# Altium schematic sheet ThermocoupleADC.SchDoc
size A3; SheetNumber: 5; SheetTotal: 6
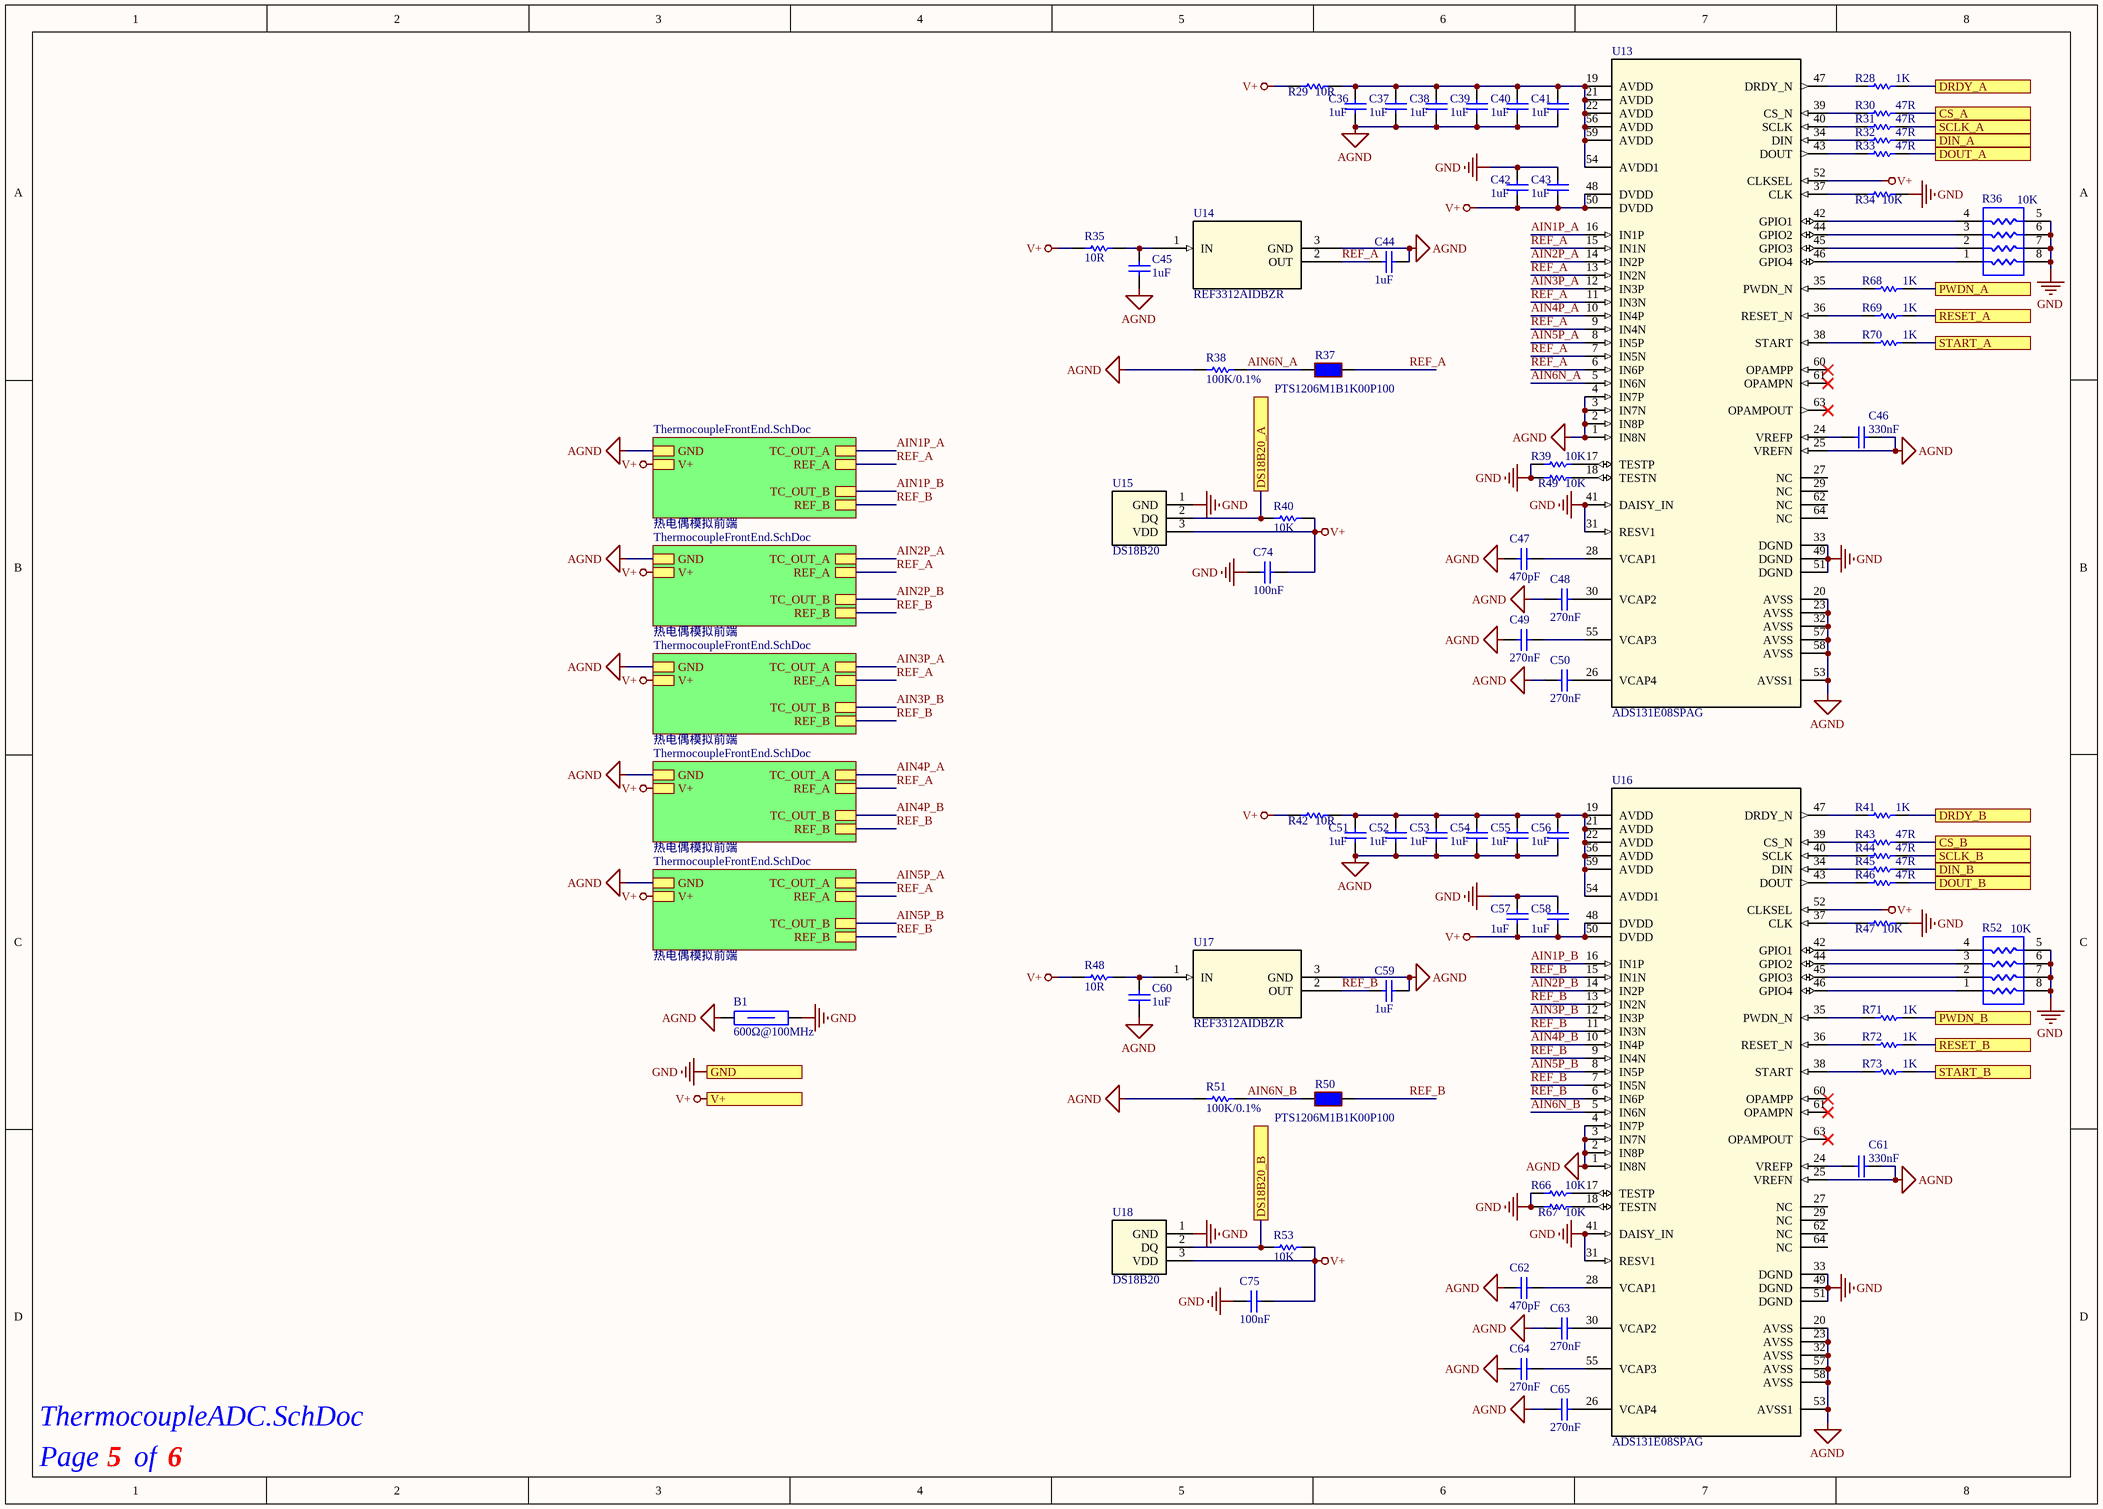
[diagram p0: ThermocoupleADC.SchDoc]

## Parts
B1  600Ω@100MHz  [R0805_L]
C36  1uF  [R0603_C]
C37  1uF  [R0603_C]
C38  1uF  [R0603_C]
C39  1uF  [R0603_C]
C40  1uF  [R0603_C]
C41  1uF  [R0603_C]
C42  1uF  [R0603_C]
C43  1uF  [R0603_C]
C44  1uF  [R0603_C]
C45  1uF  [R0603_C]
C46  330nF  [R0603_C]
C47  470pF  [R0603_C]
C48  270nF  [R0603_C]
C49  270nF  [R0603_C]
C50  270nF  [R0603_C]
C51  1uF  [R0603_C]
C52  1uF  [R0603_C]
C53  1uF  [R0603_C]
C54  1uF  [R0603_C]
C55  1uF  [R0603_C]
C56  1uF  [R0603_C]
C57  1uF  [R0603_C]
C58  1uF  [R0603_C]
C59  1uF  [R0603_C]
C60  1uF  [R0603_C]
C61  330nF  [R0603_C]
C62  470pF  [R0603_C]
C63  270nF  [R0603_C]
C64  270nF  [R0603_C]
C65  270nF  [R0603_C]
C74  100nF  [R0603_C]
C75  100nF  [R0603_C]
R28  1K  [R0603_R]
R29  10R  [R0603_R]
R30  47R  [R0603_R]
R31  47R  [R0603_R]
R32  47R  [R0603_R]
R33  47R  [R0603_R]
R34  10K  [R0603_R]
R35  10R  [R0603_R]
R36  10K  [R0603X4]
R37  PTS1206M1B1K00P100  [R1206_R]
R38  100K/0.1%  [R0603_R]
R39  10K  [R0603_R]
R40  10K  [R0603_R]
R41  1K  [R0603_R]
R42  10R  [R0603_R]
R43  47R  [R0603_R]
R44  47R  [R0603_R]
R45  47R  [R0603_R]
R46  47R  [R0603_R]
R47  10K  [R0603_R]
R48  10R  [R0603_R]
R49  10K  [R0603_R]
R50  PTS1206M1B1K00P100  [R1206_R]
R51  100K/0.1%  [R0603_R]
R52  10K  [R0603X4]
R53  10K  [R0603_R]
R66  10K  [R0603_R]
R67  10K  [R0603_R]
R68  1K  [R0603_R]
R69  1K  [R0603_R]
R70  1K  [R0603_R]
R71  1K  [R0603_R]
R72  1K  [R0603_R]
R73  1K  [R0603_R]
U13  ADS131E08SPAG  [TQFP-64]
U14  REF3312AIDBZR  [SOT-23(SOT-23-3)]
U15  DS18B20  [TO-92]
U16  ADS131E08SPAG  [TQFP-64]
U17  REF3312AIDBZR  [SOT-23(SOT-23-3)]
U18  DS18B20  [TO-92]

## Sub-sheets
U_Thermocouple channel = ThermocoupleFrontEnd.SchDoc: GND, V+, TC_OUT_B, TC_OUT_A, REF_A, REF_B  | Parameter 2: 热电偶模拟前端
U_Thermocouple channel = ThermocoupleFrontEnd.SchDoc: GND, V+, TC_OUT_B, TC_OUT_A, REF_A, REF_B  | Parameter 2: 热电偶模拟前端
U_Thermocouple channel = ThermocoupleFrontEnd.SchDoc: GND, V+, TC_OUT_B, TC_OUT_A, REF_A, REF_B  | Parameter 2: 热电偶模拟前端
U_Thermocouple channel = ThermocoupleFrontEnd.SchDoc: GND, V+, TC_OUT_B, TC_OUT_A, REF_A, REF_B  | Parameter 2: 热电偶模拟前端
U_Thermocouple channel = ThermocoupleFrontEnd.SchDoc: GND, V+, TC_OUT_B, TC_OUT_A, REF_A, REF_B  | Parameter 2: 热电偶模拟前端

## Ports
CS_A, CS_B, DIN_A, DIN_B, DOUT_A, DOUT_B, DRDY_A, DRDY_B, DS18B20_A, DS18B20_B, GND, PWDN_A, PWDN_B, RESET_A, RESET_B, SCLK_A, SCLK_B, START_A, START_B, V+

## Nets
AGND: B1.2 C36.1 C37.1 C38.1 C39.1 C40.1 C41.1 C44.1 C45.1 C46.1 C47.2 C48.2 C49.2 C50.2 C51.1 C52.1 C53.1 C54.1 C55.1 C56.1 C59.1 C60.1 C61.1 C62.2 C63.2 C64.2 C65.2 R38.2 R51.2 U13.1(IN8N) U13.2(IN8P) U13.3(IN7N) U13.4(IN7P) U13.20(AVSS) U13.23(AVSS) U13.25(VREFN) U13.32(AVSS) U13.53(AVSS1) U13.57(AVSS) U13.58(AVSS) U14.3(GND) U16.1(IN8N) U16.2(IN8P) U16.3(IN7N) U16.4(IN7P) U16.20(AVSS) U16.23(AVSS) U16.25(VREFN) U16.32(AVSS) U16.53(AVSS1) U16.57(AVSS) U16.58(AVSS) U17.3(GND) ; sheet U_Thermocouple channel/GND, sheet U_Thermocouple channel/GND, sheet U_Thermocouple channel/GND, sheet U_Thermocouple channel/GND, sheet U_Thermocouple channel/GND
GND: B1.1 C42.2 C43.2 C57.2 C58.2 C74.2 C75.2 R34.2 R36.5 R36.6 R36.7 R36.8 R39.2 R47.2 R49.2 R52.5 R52.6 R52.7 R52.8 R66.2 R67.2 U13.31(RESV1) U13.33(DGND) U13.41(DAISY_IN) U13.49(DGND) U13.51(DGND) U15.1(GND) U16.31(RESV1) U16.33(DGND) U16.41(DAISY_IN) U16.49(DGND) U16.51(DGND) U18.1(GND) ; port GND
V+: C42.1 C43.1 C57.1 C58.1 C74.1 C75.1 R29.1 R35.1 R40.2 R42.1 R48.1 R53.2 U13.48(DVDD) U13.50(DVDD) U13.52(CLKSEL) U15.3(VDD) U16.48(DVDD) U16.50(DVDD) U16.52(CLKSEL) U18.3(VDD) ; port V+, sheet U_Thermocouple channel/V+, sheet U_Thermocouple channel/V+, sheet U_Thermocouple channel/V+, sheet U_Thermocouple channel/V+, sheet U_Thermocouple channel/V+
AIN1P_A: U13.16(IN1P) ; sheet U_Thermocouple channel/TC_OUT_A
AIN1P_B: U16.16(IN1P) ; sheet U_Thermocouple channel/TC_OUT_B
AIN2P_A: U13.14(IN2P) ; sheet U_Thermocouple channel/TC_OUT_A
AIN2P_B: U16.14(IN2P) ; sheet U_Thermocouple channel/TC_OUT_B
AIN3P_A: U13.12(IN3P) ; sheet U_Thermocouple channel/TC_OUT_A
AIN3P_B: U16.12(IN3P) ; sheet U_Thermocouple channel/TC_OUT_B
AIN4P_A: U13.10(IN4P) ; sheet U_Thermocouple channel/TC_OUT_A
AIN4P_B: U16.10(IN4P) ; sheet U_Thermocouple channel/TC_OUT_B
AIN5P_A: U13.8(IN5P) ; sheet U_Thermocouple channel/TC_OUT_A
AIN5P_B: U16.8(IN5P) ; sheet U_Thermocouple channel/TC_OUT_B
AIN6N_A: R37.2 R38.1 U13.5(IN6N)
AIN6N_B: R50.2 R51.1 U16.5(IN6N)
CS_A: R30.2 ; port CS_A
CS_B: R43.2 ; port CS_B
DIN_A: R32.2 ; port DIN_A
DIN_B: R45.2 ; port DIN_B
DOUT_A: R33.2 ; port DOUT_A
DOUT_B: R46.2 ; port DOUT_B
DRDY_A: R28.2 ; port DRDY_A
DRDY_B: R41.2 ; port DRDY_B
DS18B20_A: R40.1 U15.2(DQ) ; port DS18B20_A
DS18B20_B: R53.1 U18.2(DQ) ; port DS18B20_B
PWDN_A: R68.2 ; port PWDN_A
PWDN_B: R71.2 ; port PWDN_B
REF_A: C44.2 R37.1 U13.6(IN6P) U13.7(IN5N) U13.9(IN4N) U13.11(IN3N) U13.13(IN2N) U13.15(IN1N) U14.2(OUT) ; sheet U_Thermocouple channel/REF_A, sheet U_Thermocouple channel/REF_A, sheet U_Thermocouple channel/REF_A, sheet U_Thermocouple channel/REF_A, sheet U_Thermocouple channel/REF_A
REF_B: C59.2 R50.1 U16.6(IN6P) U16.7(IN5N) U16.9(IN4N) U16.11(IN3N) U16.13(IN2N) U16.15(IN1N) U17.2(OUT) ; sheet U_Thermocouple channel/REF_B, sheet U_Thermocouple channel/REF_B, sheet U_Thermocouple channel/REF_B, sheet U_Thermocouple channel/REF_B, sheet U_Thermocouple channel/REF_B
RESET_A: R69.2 ; port RESET_A
RESET_B: R72.2 ; port RESET_B
SCLK_A: R31.2 ; port SCLK_A
SCLK_B: R44.2 ; port SCLK_B
START_A: R70.2 ; port START_A
START_B: R73.2 ; port START_B
NetC36_2: C36.2 C37.2 C38.2 C39.2 C40.2 C41.2 R29.2 U13.19(AVDD) U13.21(AVDD) U13.22(AVDD) U13.54(AVDD1) U13.56(AVDD) U13.59(AVDD)
NetC45_2: C45.2 R35.2 U14.1(IN)
NetC46_2: C46.2 U13.24(VREFP)
NetC47_1: C47.1 U13.28(VCAP1)
NetC48_1: C48.1 U13.30(VCAP2)
NetC49_1: C49.1 U13.55(VCAP3)
NetC50_1: C50.1 U13.26(VCAP4)
NetC51_2: C51.2 C52.2 C53.2 C54.2 C55.2 C56.2 R42.2 U16.19(AVDD) U16.21(AVDD) U16.22(AVDD) U16.54(AVDD1) U16.56(AVDD) U16.59(AVDD)
NetC60_2: C60.2 R48.2 U17.1(IN)
NetC61_2: C61.2 U16.24(VREFP)
NetC62_1: C62.1 U16.28(VCAP1)
NetC63_1: C63.1 U16.30(VCAP2)
NetC64_1: C64.1 U16.55(VCAP3)
NetC65_1: C65.1 U16.26(VCAP4)
NetR28_1: R28.1 U13.47(DRDY_N)
NetR30_1: R30.1 U13.39(CS_N)
NetR31_1: R31.1 U13.40(SCLK)
NetR32_1: R32.1 U13.34(DIN)
NetR33_1: R33.1 U13.43(DOUT)
NetR34_1: R34.1 U13.37(CLK)
NetR36_1: R36.1 U13.46(GPIO4)
NetR36_2: R36.2 U13.45(GPIO3)
NetR36_3: R36.3 U13.44(GPIO2)
NetR36_4: R36.4 U13.42(GPIO1)
NetR39_1: R39.1 U13.17(TESTP)
NetR41_1: R41.1 U16.47(DRDY_N)
NetR43_1: R43.1 U16.39(CS_N)
NetR44_1: R44.1 U16.40(SCLK)
NetR45_1: R45.1 U16.34(DIN)
NetR46_1: R46.1 U16.43(DOUT)
NetR47_1: R47.1 U16.37(CLK)
NetR49_1: R49.1 U13.18(TESTN)
NetR52_1: R52.1 U16.46(GPIO4)
NetR52_2: R52.2 U16.45(GPIO3)
NetR52_3: R52.3 U16.44(GPIO2)
NetR52_4: R52.4 U16.42(GPIO1)
NetR66_1: R66.1 U16.17(TESTP)
NetR67_1: R67.1 U16.18(TESTN)
NetR68_1: R68.1 U13.35(PWDN_N)
NetR69_1: R69.1 U13.36(RESET_N)
NetR70_1: R70.1 U13.38(START)
NetR71_1: R71.1 U16.35(PWDN_N)
NetR72_1: R72.1 U16.36(RESET_N)
NetR73_1: R73.1 U16.38(START)

Not connected (* = marked no-connect by the designer): U13 27(NC) 29(NC) 60(OPAMPP)* 61(OPAMPN)* 62(NC) 63(OPAMPOUT)* 64(NC); U16 27(NC) 29(NC) 60(OPAMPP)* 61(OPAMPN)* 62(NC) 63(OPAMPOUT)* 64(NC)

## Notes on the sheet
- Page
- of

## Library data of the parts
B1 = 600Ω@100MHz: 600Ω @ 100MHz / 线路数 1 / 额定电流（最大） 600mA / 直流电阻（DCR）（最大） 210mΩ; 厂家: muRata(村田); 型号: BLM21AG601SN1D; 封装: 0805; 类型: Bead; 订货编码: C85837
C36-C45 C51-C60 = 1uF/0603/50V: 精度 ±10% / 容值 1uF / 额定电压 50V / 温漂系数（介质材料) X7R; 厂家: FH(风华); 型号: 0603B105K500NT; 封装: 0603; 类型: Capacitor; 订货编码: C90540
C46 C61 = 330nF/0603/25V: 精度 ±10% / 容值 330nF / 额定电压 25V / 温漂系数（介质材料) X7R; 厂家: FH(风华); 型号: 0603B334K250NT; 封装: 0603; 类型: Capacitor; 订货编码: C1615
C47 C62 = 470pF/0603/50V: 精度 ±5% / 容值 470pF / 额定电压 50V / 温漂系数（介质材料) C0G; 厂家: FH(风华); 型号: 0603CG471J500NT; 封装: 0603; 类型: Capacitor; 订货编码: C36252
C48-C50 C63-C65 = 270nF/0603/50V: 精度 ±10% / 容值 270nF / 额定电压 50V / 温漂系数（介质材料) X7R; 厂家: CCTC(三环); 型号: TCC0603X7R274K500CT; 封装: 0603; 类型: Capacitor; 订货编码: C376826
C74 C75 = 100nF/0603/50V: 精度 ±10% / 容值 100nF / 额定电压 50V / 温漂系数（介质材料) X7R; 厂家: FH(风华); 型号: 0603B104K500NT; 封装: 0603; 类型: Capacitor; 订货编码: C30926
R28 R41 R68-R73 = 1K/0603: 精度 ±1% / 温度系数 ±100ppm/℃ / 阻值 1kΩ / 功率 0.1W; 厂家: FH(风华); 型号: RS-03K1001FT; 类型: Resistor; 订货编码: C115325; 封装: 0603
R29 R35 R42 R48 = 10R/0603: 精度 ±1% / 阻值 10Ω / 温度系数 ±100ppm/℃ / 功率 0.1W; 厂家: FH(风华); 型号: RS-03K10R0FT; 类型: Resistor; 订货编码: C136596; 封装: 0603
R30-R33 R43-R46 = 47R/0603: 精度 ±1% / 温度系数 ±100ppm/℃ / 阻值 47Ω / 功率 0.1W; 厂家: FH(风华); 型号: RS-03K47R0FT; 类型: Resistor; 订货编码: C140087; 封装: 0603
R34 R39 R40 R47 R49 R53 R66 R67 = 10K/0603: 精度 ±1% / 温度系数 ±100ppm/℃ / 阻值 10kΩ / 功率 0.1W; 厂家: FH(风华); 型号: RS-03K1002FT; 类型: Resistor; 订货编码: C115324; 封装: 0603
R36 R52 = 10K/0603X4: 10K / 电阻器数 4 / 精度 ±1% / 安装类型 表面贴装 / 每元件功率 1/16W / 温度系数 ±200ppm/℃; 厂家: UNI-ROYAL(厚声); 型号: 4D03WGF1002T5E; 类型: Resistor; 订货编码: C425238; 封装: 0603_x4
R37 R50 = PTS1206M1B1K00P100: PT1000; 厂家: FH(风华); 类型: Resistor; 订货编码: C320418; 封装: 1206; 型号: PTS1206M1B1K00P100
R38 R51 = 100K/0603/0.1%: 精度 ±0.1% / 阻值 100kΩ / 功率 0.1W; 厂家: YAGEO(国巨); 型号: RT0603BRE07100KL; 类型: Resistor; 订货编码: C326758; 封装: 0603
U13 U16 = ADS131E08SPAG: -; 厂家: TI(德州仪器); 类型: 模数转换芯片; 订货编码: C1520670; 型号: ADS131E08SPAG; 封装: TQFP-64
U14 U17 = REF3312AIDBZR: 电压参考; 厂家: TI(德州仪器); 封装: SOT23-3; 类型: 电源参考; 订货编码: C183104; 型号: REF3312AIDBZR
U15 U18 = DS18B20: 温度传感器2.5~5.5V; 厂家: UMW(友台半导体); 类型: 温度传感器; 订货编码: C473912; 型号: DS18B20; 封装: TO-92